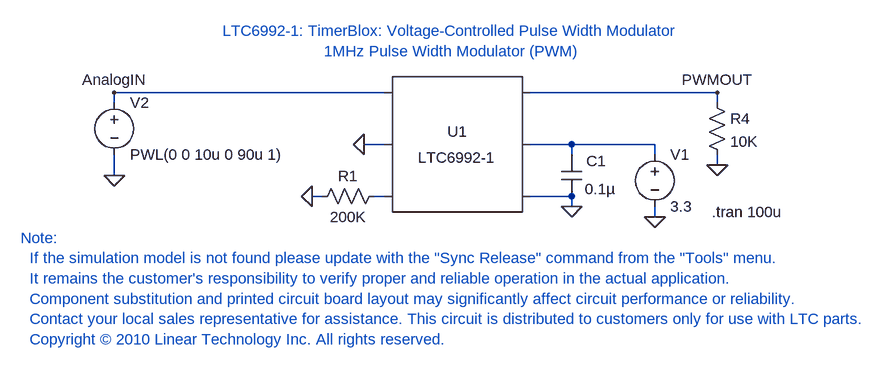
[diagram p0: schematic LTC6992-1_TA01A.asc]
LTC6992-1_TA01A.asc, the LTspice schematic file:
Version 4
SHEET 1 996 680
WIRE 96 96 -320 96
WIRE 608 96 320 96
WIRE -320 112 -320 96
WIRE 608 112 608 96
WIRE 96 176 64 176
WIRE 384 176 320 176
WIRE 512 176 384 176
WIRE 384 192 384 176
WIRE 512 192 512 176
WIRE 608 208 608 192
WIRE -320 224 -320 192
WIRE 0 256 -16 256
WIRE 96 256 80 256
WIRE 384 256 320 256
WIRE 384 272 384 256
WIRE 512 288 512 272
FLAG -320 224 0
FLAG 512 288 0
FLAG 608 96 PWMOUT
FLAG 608 208 0
FLAG 384 272 0
FLAG -16 256 0
FLAG 64 176 0
FLAG -320 96 AnalogIN
SYMBOL res 96 240 R90
WINDOW 0 0 56 VBottom 0
WINDOW 3 32 56 VTop 0
SYMATTR InstName R1
SYMATTR Value 200K
SYMBOL res 592 96 R0
SYMATTR InstName R4
SYMATTR Value 10K
SYMBOL voltage 512 176 R0
WINDOW 123 0 0 Left 0
WINDOW 39 0 0 Left 0
SYMATTR InstName V1
SYMATTR Value 3.3
SYMBOL voltage -320 96 R0
WINDOW 123 24 146 Left 0
WINDOW 39 24 125 Left 0
SYMATTR Value PWL(0 0 10u 0 90u 1)
SYMATTR InstName V2
SYMBOL SpecialFunctions\\LTC6992-1 208 176 R0
SYMATTR InstName U1
SYMBOL cap 368 192 R0
WINDOW 0 39 10 Left 0
WINDOW 3 36 53 Left 0
SYMATTR InstName C1
SYMATTR Value 0.1µ
SYMATTR SpiceLine Rser=.003
TEXT 600 280 Left 0 !.tran 100u
TEXT -464 320 Left 0 ;Note:\n  If the simulation model is not found please update with the "Sync Release" command from the "Tools" menu.\n  It remains the customer's responsibility to verify proper and reliable operation in the actual application.\n  Component substitution and printed circuit board layout may significantly affect circuit performance or reliability.\n  Contact your local sales representative for assistance. This circuit is distributed to customers only for use with LTC parts.\n  Copyright © 2010 Linear Technology Inc. All rights reserved.
TEXT 200 48 Bottom 0 ;LTC6992-1: TimerBlox: Voltage-Controlled Pulse Width Modulator\n1MHz Pulse Width Modulator (PWM)

The netlist it stands for:
* LTC6992-1_TA01A.asc
R1 N002 0 200K
R4 PWMOUT 0 10K
V1 N001 0 3.3
V2 AnalogIN 0 PWL(0 0 10u 0 90u 1)
XU1 AnalogIN 0 N002 0 N001 PWMOUT LTC6992-1
C1 N001 0 0.1µ Rser=.003
.tran 100u
* Note:
*   If the simulation model is not found please update with the "Sync Release" command from the "Tools" menu.
*   It remains the customer's responsibility to verify proper and reliable operation in the actual application.
*   Component substitution and printed circuit board layout may significantly affect circuit performance or reliability.
*   Contact your local sales representative for assistance. This circuit is distributed to customers only for use with LTC parts.
*   Copyright © 2010 Linear Technology Inc. All rights reserved.
* LTC6992-1: TimerBlox: Voltage-Controlled Pulse Width Modulator
* 1MHz Pulse Width Modulator (PWM)
.lib LTC6992-1.sub
.backanno
.end